# EasyEDA Pro project OpenIPC-Optical(工程文件)2025-11-24.epro, schematic OpenIPC_Opticalboard

## Sheets
1 P1: Board Name: OpenIPC_Opticalboard; Create Date: 2025-08-15; Page Name: P1; Project Name: OpenIPC-Optical; Schematic Name: OpenIPC_Opticalboard; Update Date: 2025-08-15; Company: CDUT; Drawed: urmouky; Page Size: A3; Version: V0.1
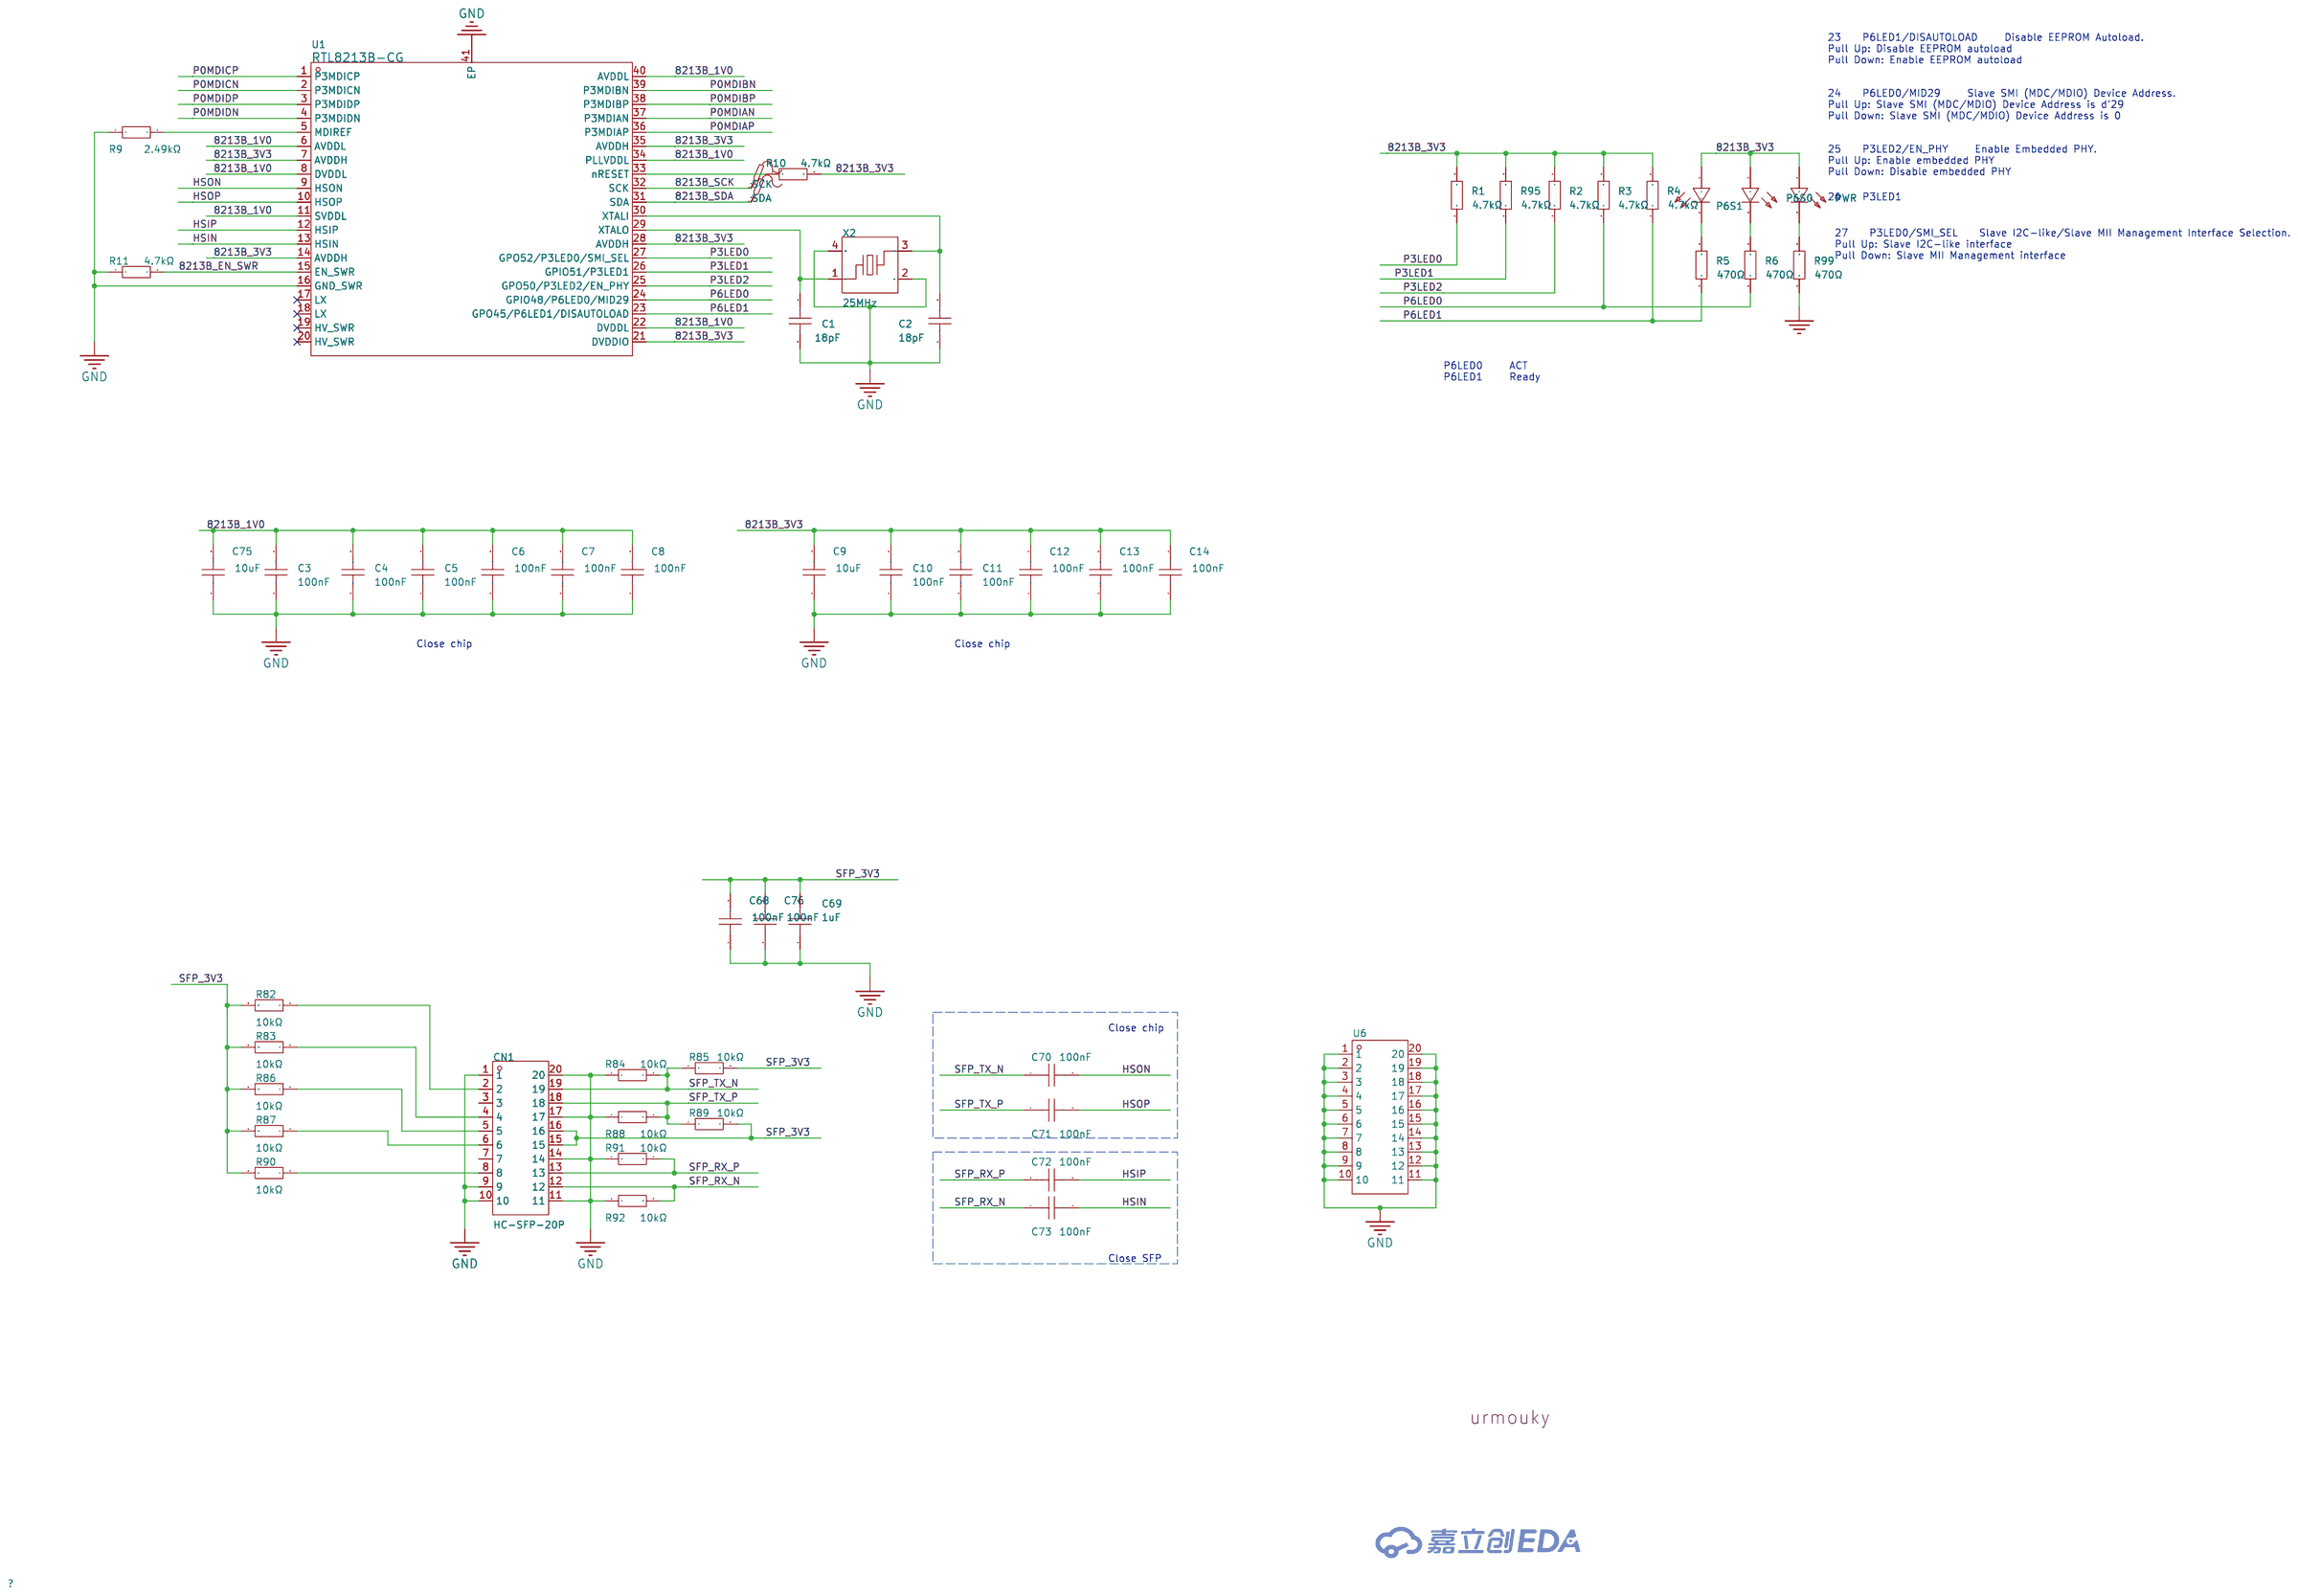
[diagram p0: P1]
2 P2: Page Name: P2
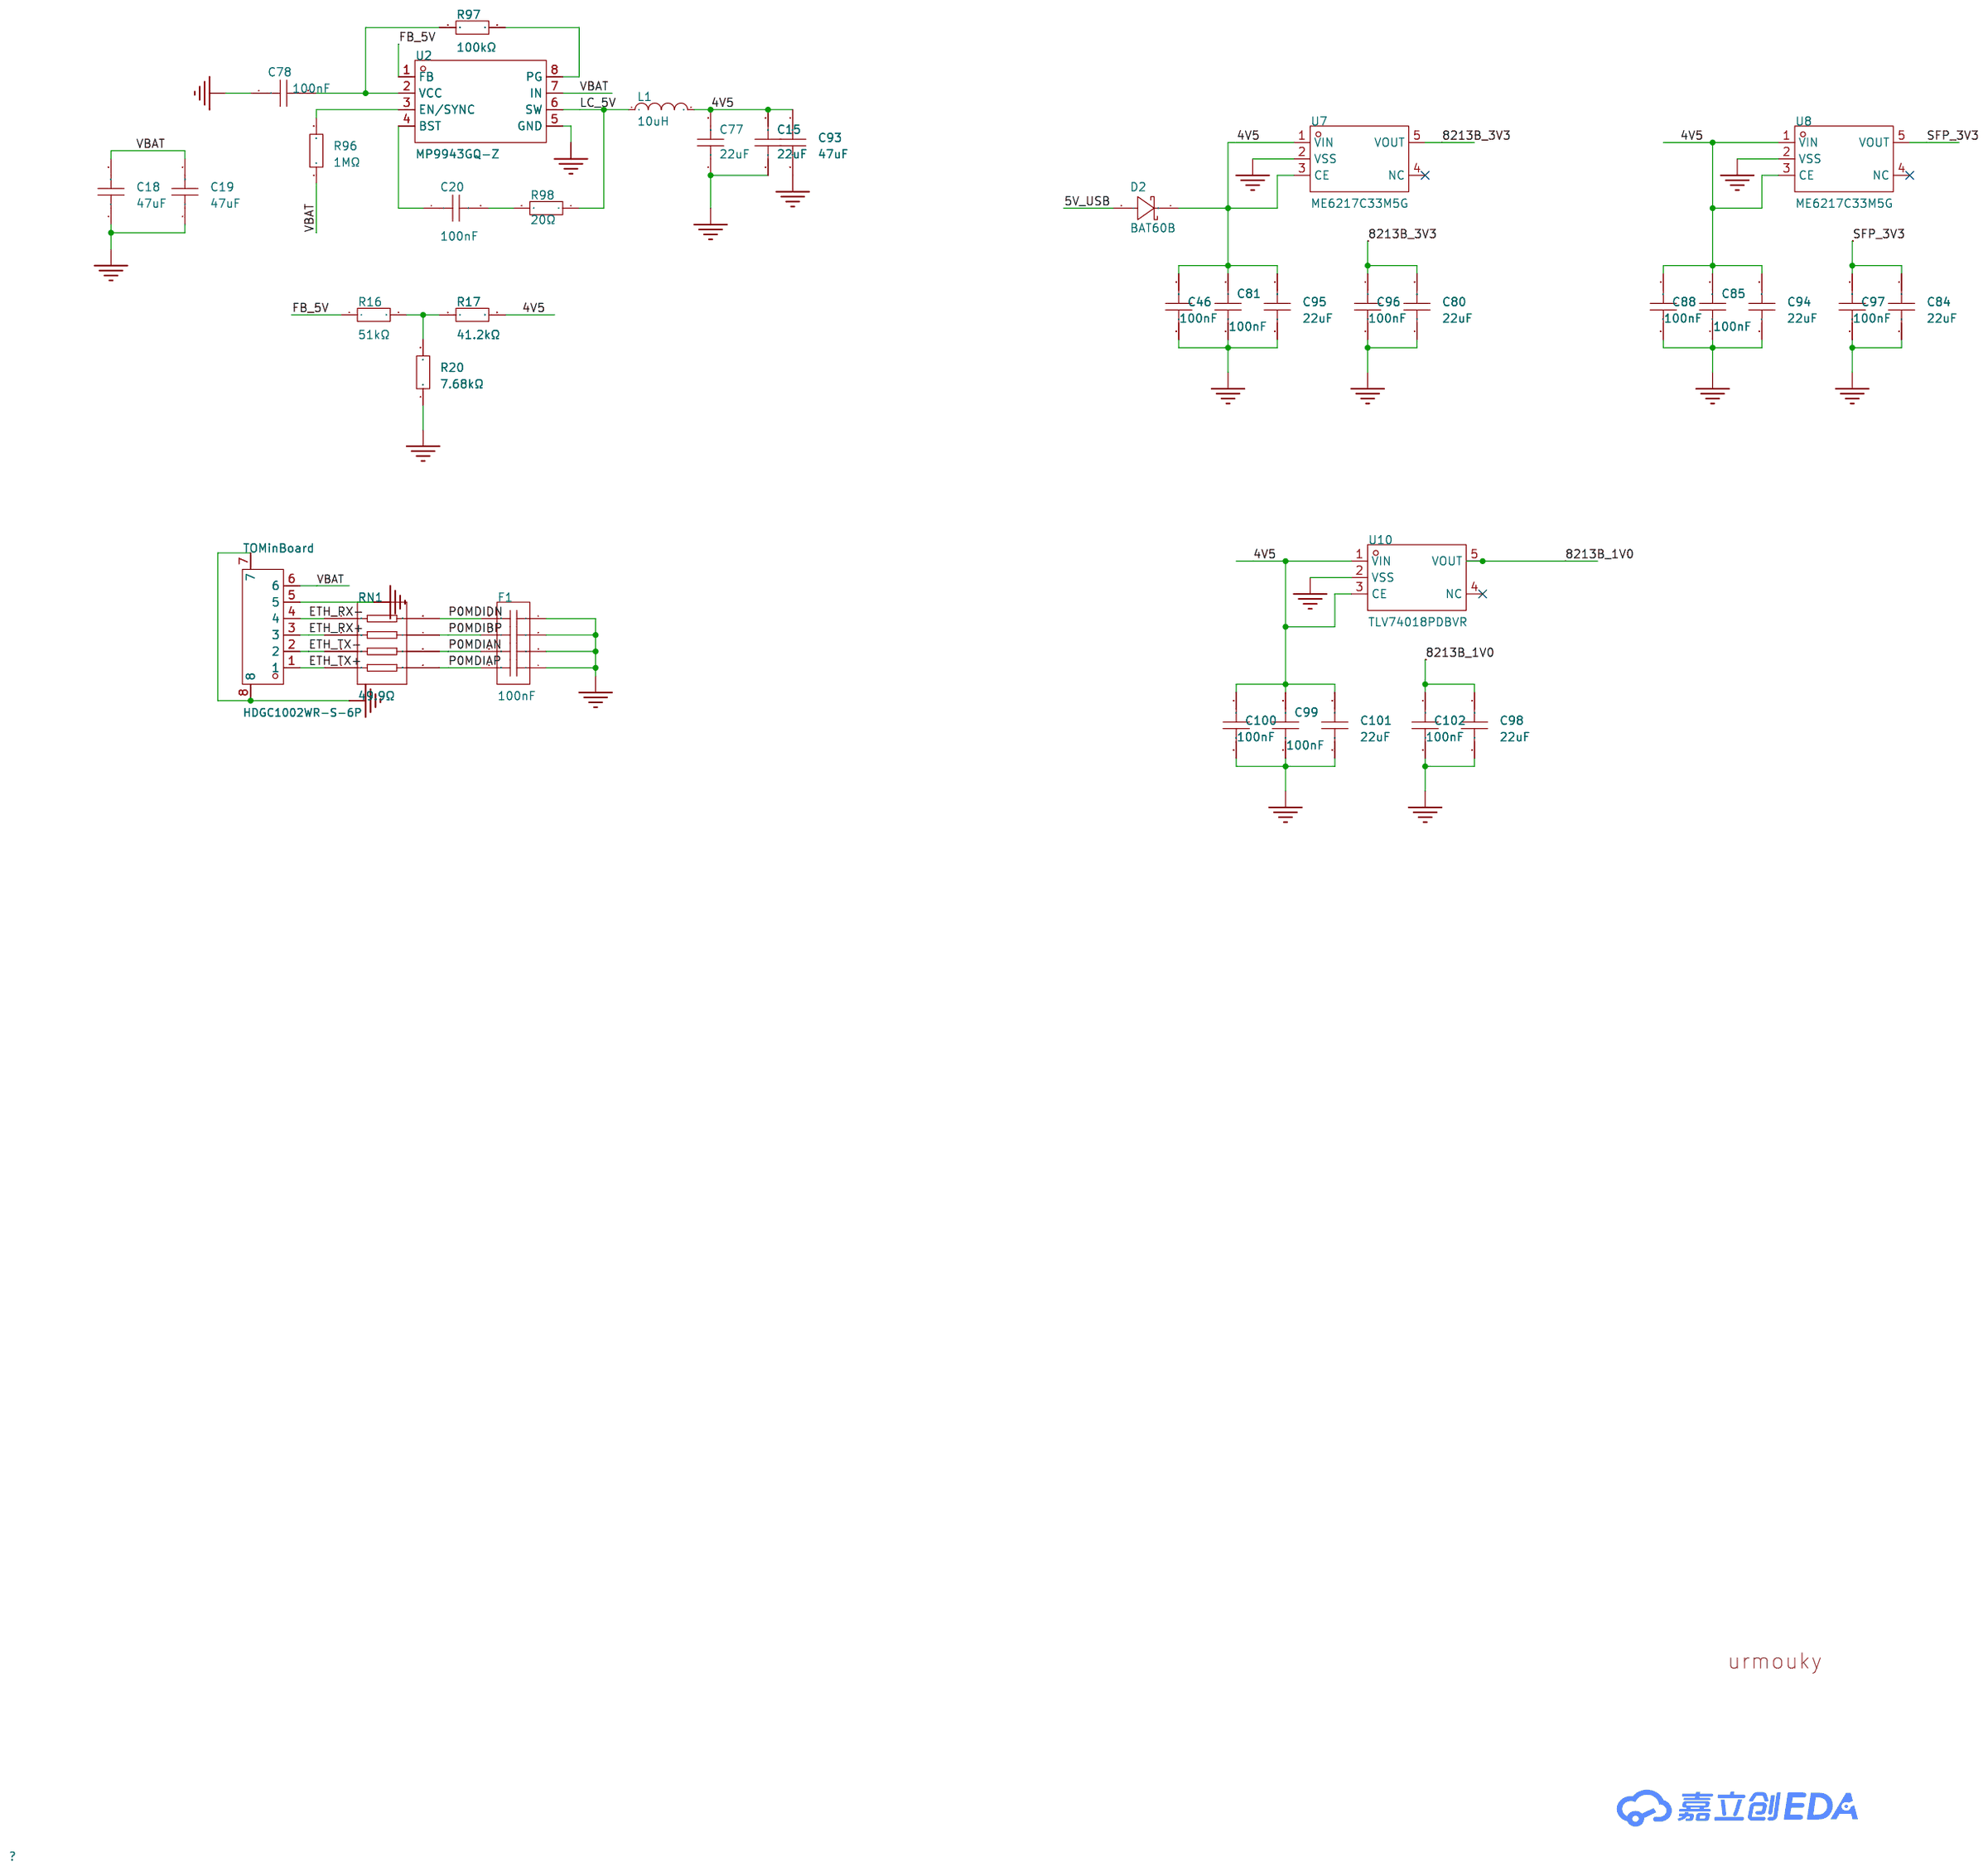
[diagram p1: P2]

## Parts
sheet P1
C1  18pF  [R0402]
C2  18pF  [R0402]
C3  100nF  [R0402]
C4  100nF  [R0402]
C5  100nF  [R0402]
C6  100nF  [R0402]
C7  100nF  [R0402]
C8  100nF  [R0402]
C9  10uF  [R0603]
C10  100nF  [R0402]
C11  100nF  [R0402]
C12  100nF  [R0402]
C13  100nF  [R0402]
C14  100nF  [R0402]
C68  100nF  [R0402]
C69  1uF  [R0603]
C70  100nF  [R0402]
C71  100nF  [R0402]
C72  100nF  [R0402]
C73  100nF  [R0402]
C75  10uF  [R0603]
C76  100nF  [R0402]
CN1  HC-SFP-20P  [CONN-SMD_20P-P0.80_HCTL_HC-SFP-20P]
P6S0  NCD0402G1  [LED0402-RD]
P6S1  NCD0402G1  [LED0402-RD]
PWR  NCD0402G1  [LED0402-RD]
R1  4.7kΩ  [R0402]
R2  4.7kΩ  [R0402]
R3  4.7kΩ  [R0402]
R4  4.7kΩ  [R0402]
R5  470Ω  [R0402]
R6  470Ω  [R0402]
R9  2.49kΩ  [R0402]
R10  4.7kΩ  [R0402]
R11  4.7kΩ  [R0402]
R82  10kΩ  [R0402]
R83  10kΩ  [R0402]
R84  10kΩ  [R0402]  (no BOM)
R85  10kΩ  [R0402]  (no BOM)
R86  10kΩ  [R0402]
R87  10kΩ  [R0402]
R88  10kΩ  [R0402]  (no BOM)
R89  10kΩ  [R0402]  (no BOM)
R90  10kΩ  [R0402]
R91  10kΩ  [R0402]  (no BOM)
R92  10kΩ  [R0402]  (no BOM)
R95  4.7kΩ  [R0402]
R99  470Ω  [R0402]
SCK  -  [Test-Point-0.5mm]
SDA  -  [Test-Point-0.5mm]
U1  RTL8213B-CG  [QFN-40_L5.0-W5.0-P0.40-BL-EP3.7]
U6  HC-SFP-01L  [TH_HC-SFP-01L]  (no BOM)
X2  25MHz  [CRYSTAL-SMD_4P-L2.0-W1.6-BL]
sheet P2
C15  22uF  [C0603]
C18  47uF  [C1206]
C19  47uF  [C1206]
C20  100nF  [C0402]
C46  100nF  [R0402]
C77  22uF  [C0603]
C78  100nF  [C0402]
C80  22uF  [C0603]
C81  100nF  [R0402]
C84  22uF  [C0603]
C85  100nF  [R0402]
C88  100nF  [R0402]
C93  47uF  [C1206]
C94  22uF  [C0603]
C95  22uF  [C0603]
C96  100nF  [R0402]
C97  100nF  [R0402]
C98  22uF  [C0603]
C99  100nF  [R0402]
C100  100nF  [R0402]
C101  22uF  [C0603]
C102  100nF  [R0402]
D2  BAT60B  [SOD-323_L1.7-W1.3-LS2.6-RD-1]
F1  100nF  [CAP-ARRAY-SMD_0508-8P-L2.0-W1.3-BL]  (no BOM)
L1  10uH  [IND-SMD_L4.4-W4.2]
R16  51kΩ  [R0402]
R17  41.2kΩ  [R0402]
R20  7.68kΩ  [R0402]
R96  1MΩ  [R0402]
R97  100kΩ  [R0402]
R98  20Ω  [R0402]
RN1  49.9Ω  [RES-ARRAY-SMD_0402-8P-L2.0-W1.0-BL]
TOMinBoard  HDGC1002WR-S-6P  [CONN-SMD_6P-P1.00_HDGC1002WR-S-6P]
U2  MP9943GQ-Z  [QFN-8_L3.0-W3.0-P0.65-BL]
U7  ME6217C33M5G  [SOT-23-5_L3.0-W1.7-P0.95-LS2.8-BR]
U8  ME6217C33M5G  [SOT-23-5_L3.0-W1.7-P0.95-LS2.8-BR]
U10  TLV74018PDBVR  [SOT-23-5_L2.9-W1.6-P0.95-LS2.8-BL]

## Library data of the parts
C1 C2 = 0402CG180J500NT: 容值:18pF;精度:±5%;额定电压:50V;材质(温度系数):C0G;; LCSC Part Name: 18pF ±5% 50V; Supplier Part: C1549; Manufacturer: FH(风华); Supplier Footprint: 0402; JLCPCB Part Class: Basic Part; Datasheet: https://atta.szlcsc.com/upload/public/pdf/source/20170923/C1549_1506149266585988356.pdf; Supplier: LCSC; Tolerance: ±5%; Voltage Rated: 50V; Temperature Coefficient: C0G
C3-C8 C10-C14 C68 C70-C73 C76 = CL05B104KO5NNNC: 容值:100nF;精度:±10%;额定电压:16V;材质(温度系数):X7R;; LCSC Part Name: 100nF ±10% 16V; Supplier Part: C1525; Manufacturer: SAMSUNG(三星); Supplier Footprint: 0402; JLCPCB Part Class: Basic Part; Datasheet: https://atta.szlcsc.com/upload/public/pdf/source/20160103/1457707674891.pdf; Supplier: LCSC; Tolerance: ±10%; Voltage Rated: 16V; Temperature Coefficient: X7R
C9 C75 = CL10A106MA8NRNC: 容值:10uF;精度:±20%;额定电压:25V;材质(温度系数):X5R;; LCSC Part Name: 10uF ±20% 25V; Supplier Part: C96446; Manufacturer: SAMSUNG(三星); Supplier Footprint: 0603; JLCPCB Part Class: Basic Part; Datasheet: https://atta.szlcsc.com/upload/public/pdf/source/20170325/1490427913016.pdf; Supplier: LCSC; Tolerance: ±20%; Voltage Rated: 25V; Temperature Coefficient: X5R
C69 = CL10A105KB8NNNC: 容值:1uF;精度:±10%;额定电压:50V;材质(温度系数):X5R;; LCSC Part Name: 1uF ±10% 50V; Supplier Part: C15849; Manufacturer: SAMSUNG(三星); Supplier Footprint: 0603; JLCPCB Part Class: Basic Part; Datasheet: https://atta.szlcsc.com/upload/public/pdf/source/20160103/1457707679084.pdf; Supplier: LCSC; Tolerance: ±10%; Voltage Rated: 50V; Temperature Coefficient: X5R
CN1 = HC-SFP-20P: Supplier Part: C2897291; Manufacturer: HCTL(华灿天禄); Supplier Footprint: SMD,P=0.8mm,卧贴; JLCPCB Part Class: Extended Part; Datasheet: https://atta.szlcsc.com/upload/public/pdf/source/20210914/BA7BB8E5B2F161D6EB896D34EBE70234.pdf; Supplier: LCSC
P6S0 P6S1 PWR = NCD0402G1: 发光颜色:翠绿色;正向电压(VF):2.6V~3.6V;功率:72mW;正向电流:5mA;主波长:515nm~530nm;透镜颜色:无色透明透镜;发光强度:100mcd~270mcd;发光角度:130°;工作温度:-30℃~+85℃;; Supplier Part: C130723; Manufacturer: 国星光电; Supplier Footprint: 0402; JLCPCB Part Class: Extended Part; Datasheet: https://atta.szlcsc.com/upload/public/pdf/source/20200820/C130723_D39B4171A1B8D8D2F39C1DC521C0922A.pdf; Supplier: LCSC; Emitted Color: 翠绿色; Forward Voltage (VF): 2.6V~3.6V; Power Dissipation: 72mW; Forward Current: 5mA; Dominant Wavelength: 515nm~530nm; Lens Color: 无色透明透镜; Luminous Intensity: 100mcd~270mcd; Viewing Angle: 130°; Operating Temperature: -30℃~+85℃
R1-R4 R10 R11 R95 = 0402WGF4701TCE: 电阻类型:厚膜电阻;阻值:4.7kΩ;精度:±1%;功率:1/16W;温度系数:±100ppm/℃;最大工作电压:50V;工作温度范围:-55℃~+155℃;; LCSC Part Name: 4.7kΩ ±1% 1/16W; Supplier Part: C25900; Manufacturer: UNI-ROYAL(厚声); Supplier Footprint: 0402; JLCPCB Part Class: Basic Part; Datasheet: https://atta.szlcsc.com/upload/public/pdf/source/20200306/C422600_1E6D84923E4A46A82E41ADD87F860B5C.pdf; Supplier: LCSC; Type: 厚膜电阻; Tolerance: ±1%; Power(Watts): 1/16W; Temperature Coefficient: ±100ppm/℃; Overload Voltage (Max): 50V; Operating Temperature Range: -55℃~+155℃
R5 R6 R99 = 0402WGF4700TCE: 电阻类型:厚膜电阻;阻值:470Ω;精度:±1%;功率:62.5mW;温度系数:±100ppm/℃;最大工作电压:50V;工作温度范围:-55℃~+155℃;; LCSC Part Name: 470Ω ±1% 62.5mW; Supplier Part: C25117; Manufacturer: UNI-ROYAL(厚声); Supplier Footprint: 0402; JLCPCB Part Class: Basic Part; Datasheet: https://atta.szlcsc.com/upload/public/pdf/source/20200306/C422600_1E6D84923E4A46A82E41ADD87F860B5C.pdf; Supplier: LCSC; Type: 厚膜电阻; Tolerance: ±1%; Power(Watts): 62.5mW; Temperature Coefficient: ±100ppm/℃; Overload Voltage (Max): 50V; Operating Temperature Range: -55℃~+155℃
R9 = RC0402FR-072K49L: 功率:1/16W;阻值:2.49kΩ;精度:±1%;温度系数:±100ppm/℃;最大工作电压:50V;工作温度范围:-55℃~+155℃;; LCSC Part Name: 2.49kΩ ±1%; Supplier Part: C145071; Manufacturer: YAGEO(国巨); Supplier Footprint: 0402; JLCPCB Part Class: Extended Part; Datasheet: https://atta.szlcsc.com/upload/public/pdf/source/20171221/C145071_15138311814201195405.pdf; Supplier: LCSC; Power(Watts): 1/16W; Tolerance: ±1%; Temperature Coefficient: ±100ppm/℃; Overload Voltage (Max): 50V; Operating Temperature Range: -55℃~+155℃
R82 R83 R86 R87 R90 = 0402WGF1002TCE: 电阻类型:厚膜电阻;阻值:10kΩ;精度:±1%;功率:62.5mW;温度系数:±100ppm/℃;最大工作电压:50V;工作温度范围:-55℃~+155℃;; LCSC Part Name: 10kΩ ±1% 62.5mW; Supplier Part: C25744; Manufacturer: UNI-ROYAL(厚声); Supplier Footprint: 0402; JLCPCB Part Class: Basic Part; Datasheet: https://atta.szlcsc.com/upload/public/pdf/source/20200306/C422600_1E6D84923E4A46A82E41ADD87F860B5C.pdf; Supplier: LCSC; Type: 厚膜电阻; Tolerance: ±1%; Power(Watts): 62.5mW; Temperature Coefficient: ±100ppm/℃; Overload Voltage (Max): 50V; Operating Temperature Range: -55℃~+155℃
R84 R85 R88 R89 R91 R92 = 0402WGF1002TCE: 电阻类型:厚膜电阻;阻值:10kΩ;精度:±1%;功率:62.5mW;工作电压:50V;温度系数:±100ppm/℃;; LCSC Part Name: 10kΩ ±1% 62.5mW; Supplier Part: C25744; Manufacturer: UNI-ROYAL(厚声); Supplier Footprint: 0402; JLCPCB Part Class: Basic Part; Datasheet: https://atta.szlcsc.com/upload/public/pdf/source/20200306/C422600_1E6D84923E4A46A82E41ADD87F860B5C.pdf; Supplier: LCSC; Type: 厚膜电阻; Tolerance: ±1%; Power(Watts): 62.5mW; Temperature Coefficient: ±100ppm/℃; Overload Voltage (Max): 50V; Operating Temperature Range: -55℃~+155℃; Voltage-Supply(Max): 50V; Operating Temperature: -55℃~+155℃
SCK SDA = Test-Point: Test Point 测试点
U1 = RTL8213B-CG: 应用功能:-;通道数:1;接口类型:SGMII;; Supplier Part: C2766076; Manufacturer: REALTEK(瑞昱); Supplier Footprint: QFN-40-EP(5x5); JLCPCB Part Class: 扩展库; Datasheet: https://atta.szlcsc.com/upload/public/pdf/source/20240125/4FAE948FC8054805EFA4DC6DA88B16DA.pdf; Supplier: LCSC; Number of Channels: 1; Interface: SGMII; Voltage - Supply: 3.3V；1.1V; Current - Supply: 70mA；218mA; Operating Temperature: 0℃~+70℃
U6 = HC-SFP-01L: LCSC Part Name: SFP外壳; Supplier Part: C2897292; Manufacturer: HCTL(华灿天禄); JLCPCB Part Class: 扩展库; Datasheet: https://atta.szlcsc.com/upload/public/pdf/source/20210914/D263BD6202628DAF148611CD07FFF2AC.pdf; Supplier: LCSC
X2 = SX1B25.000F1210F30: 晶振类型:贴片晶振;频率:25MHz;常温频差:±10ppm;负载电容:12pF;频率稳定度:±30ppm;; LCSC Part Name: 25MHz ±10ppm 12pF; Supplier Part: C7301945; Manufacturer: SCTF(星通时频); Supplier Footprint: SMD2016-4P; JLCPCB Part Class: 扩展库; Datasheet: https://item.szlcsc.com/datasheet/SX1B25.000F1210F30/8272198.html; Supplier: LCSC; Type: 贴片晶振; Normal temperature Frequency Tolerance: ±10ppm; Load Capacitance: 12pF; Frequency Stability: ±30ppm; Equivalent Series Resistance(ESR): 80Ω; Operating Temperature: -40℃~+85℃
C15 C77 C80 C84 C94 C95 C98 C101 = CL10A226MQ8NRNC: 容值:22uF;精度:±20%;额定电压:6.3V;材质(温度系数):X5R;; LCSC Part Name: 22uF ±20% 6.3V; Supplier Part: C59461; Manufacturer: SAMSUNG(三星); Supplier Footprint: 0603; JLCPCB Part Class: Basic Part; Datasheet: https://atta.szlcsc.com/upload/public/pdf/source/20160218/1457707763339.pdf; Supplier: LCSC; Tolerance: ±20%; Voltage Rated: 6.3V; Temperature Coefficient: X5R
C18 C19 C93 = CL31A476MPHNNNE: 容值:47uF;精度:±20%;额定电压:10V;材质(温度系数):X5R;; LCSC Part Name: 47uF ±20% 10V; Supplier Part: C96123; Manufacturer: SAMSUNG(三星); Supplier Footprint: 1206; JLCPCB Part Class: Basic Part; Datasheet: https://atta.szlcsc.com/upload/public/pdf/source/20170228/1488267692219.pdf; Supplier: LCSC; Tolerance: ±20%; Voltage Rated: 10V; Temperature Coefficient: X5R
C20 C78 C81 C85 C99 = GRM155R71H104KE14D: 容值:100nF;精度:±10%;额定电压:50V;材质(温度系数):X7R;; LCSC Part Name: 100nF ±10% 50V; Supplier Part: C77020; Manufacturer: muRata(村田); Supplier Footprint: 0402; JLCPCB Part Class: Extended Part; Datasheet: https://atta.szlcsc.com/upload/public/pdf/source/20180326/C77020_39BD49C951FF1AF0DB1F1FAC5AC1E401.pdf; Supplier: LCSC; Tolerance: ±10%; Voltage Rated: 50V; Temperature Coefficient: X7R
C46 C88 C96 C97 C100 C102 = GRM155R71H104KE14D: 容值:100nF;精度:±10%;额定电压:50V;材质(温度系数):X7R;; LCSC Part Name: 100nF ±10% 50V; Supplier Part: C77020; Manufacturer: muRata(村田); Supplier Footprint: 0402; JLCPCB Part Class: Extended Part; Datasheet: https://atta.szlcsc.com/upload/public/pdf/source/20180326/C77020_39BD49C951FF1AF0DB1F1FAC5AC1E401.pdf; Supplier: LCSC; Tolerance: ±10%; Voltage Rated: 50V; Temperature Coefficient: X7R; 3DModel: C0402_L1.0-W0.5-H0.5
D2 = BAT60B_C7502695: 二极管配置:独立式;正向压降(Vf):600mV@1A;直流反向耐压(Vr):10V;整流电流:3A;; LCSC Part Name: 电压:10V 电流:3A; Supplier Part: C7502695; Manufacturer: 宏迦橙; Supplier Footprint: SOD-323; JLCPCB Part Class: Extended Part; Datasheet: https://atta.szlcsc.com/upload/public/pdf/source/20230828/25AE167151E881636AF68D9C9ECB5F9C.pdf; Supplier: LCSC; Diode Configuration: 独立式; Forward Voltage (Vf@If): 600mV@1A; Reverse Voltage (Vr): 10V; Rectified Current: 3A; Reverse Leakage Current (Ir): 25uA; Average Rectified Current (Io): 3A
F1 = CA0508KRX7R7BB104: 容值:100nF;精度:±10%;额定电压:16V;温度系数:X7R;电路形式:隔离;; Supplier Part: C1870407; Manufacturer: YAGEO(国巨); Supplier Footprint: 0508; JLCPCB Part Class: 扩展库; Datasheet: https://atta.szlcsc.com/upload/public/pdf/source/20220525/176E31E9D3C0708DD2DF020B4CF8BD4B.pdf; Supplier: LCSC; Tolerance: ±10%; Rated Voltage: 16V; Temperature Coefficient: X7R; Number of Capacitors: 4; Circuit Type: 隔离
L1 = FXL0420-100-M: 电感值:10uH;精度:±20%;额定电流:1.6A;饱和电流(Isat):2.2A;类型:一体成型电感;; LCSC Part Name: 10uH ±20% 2.2A; Supplier Part: C177242; Manufacturer: cjiang(长江微电); Supplier Footprint: SMD,4.2x4.4mm; JLCPCB Part Class: Extended Part; Datasheet: https://atta.szlcsc.com/upload/public/pdf/source/20200117/C485363_A2440626DC7482D75DD0DD56D1883FBF.pdf; Supplier: LCSC; Tolerance: ±20%; Rated Current: 1.6A; Saturation Current (Isat): 2.2A; DC Resistance (DCR): 282mΩ; Type: 一体成型电感
R16 = 0402WGF5102TCE: 电阻类型:厚膜电阻;阻值:51kΩ;精度:±1%;功率:62.5mW;最大工作电压:50V;温度系数:±100ppm/℃;; LCSC Part Name: 51kΩ ±1% 62.5mW 厚膜电阻; Supplier Part: C25794; Manufacturer: UNI-ROYAL(厚声); Supplier Footprint: 0402; JLCPCB Part Class: Basic Part; Datasheet: https://atta.szlcsc.com/upload/public/pdf/source/20200306/C422600_1E6D84923E4A46A82E41ADD87F860B5C.pdf; Supplier: LCSC; Type: 厚膜电阻; Tolerance: ±1%; Power(Watts): 62.5mW; Overload Voltage (Max): 50V; Temperature Coefficient: ±100ppm/℃; Operating Temperature Range: -55℃~+155℃
R17 = 0402WGF4122TCE: 电阻类型:厚膜电阻;阻值:41.2kΩ;精度:±1%;功率:62.5mW;最大工作电压:50V;温度系数:±100ppm/℃;; LCSC Part Name: 41.2kΩ ±1% 62.5mW 厚膜电阻; Supplier Part: C26978; Manufacturer: UNI-ROYAL(厚声); Supplier Footprint: 0402; JLCPCB Part Class: Extended Part; Datasheet: https://atta.szlcsc.com/upload/public/pdf/source/20200306/C422600_1E6D84923E4A46A82E41ADD87F860B5C.pdf; Supplier: LCSC; Type: 厚膜电阻; Tolerance: ±1%; Power(Watts): 62.5mW; Overload Voltage (Max): 50V; Temperature Coefficient: ±100ppm/℃; Operating Temperature Range: -55℃~+155℃
R20 = 0402WGF7681TCE: 电阻类型:厚膜电阻;阻值:7.68kΩ;精度:±1%;功率:62.5mW;最大工作电压:50V;温度系数:±100ppm/℃;; LCSC Part Name: 7.68kΩ ±1% 62.5mW 厚膜电阻; Supplier Part: C25919; Manufacturer: UNI-ROYAL(厚声); Supplier Footprint: 0402; JLCPCB Part Class: Extended Part; Datasheet: https://atta.szlcsc.com/upload/public/pdf/source/20200306/C422600_1E6D84923E4A46A82E41ADD87F860B5C.pdf; Supplier: LCSC; Type: 厚膜电阻; Tolerance: ±1%; Power(Watts): 62.5mW; Overload Voltage (Max): 50V; Temperature Coefficient: ±100ppm/℃; Operating Temperature Range: -55℃~+155℃
R96 = 0402WGF1004TCE: 电阻类型:厚膜电阻;阻值:1MΩ;精度:±1%;功率:62.5mW;最大工作电压:50V;温度系数:±100ppm/℃;; LCSC Part Name: 1MΩ ±1% 62.5mW 厚膜电阻; Supplier Part: C26083; Manufacturer: UNI-ROYAL(厚声); Supplier Footprint: 0402; JLCPCB Part Class: Basic Part; Datasheet: https://atta.szlcsc.com/upload/public/pdf/source/20200306/C422600_1E6D84923E4A46A82E41ADD87F860B5C.pdf; Supplier: LCSC; Type: 厚膜电阻; Tolerance: ±1%; Power(Watts): 62.5mW; Overload Voltage (Max): 50V; Temperature Coefficient: ±100ppm/℃; Operating Temperature Range: -55℃~+155℃
R97 = RC0402FR-07100KL: 电阻类型:厚膜电阻;阻值:100kΩ;精度:±1%;功率:62.5mW;最大工作电压:50V;温度系数:±100ppm/℃;; LCSC Part Name: 厚膜电阻 100kΩ ±1% 62.5mW; Supplier Part: C60491; Manufacturer: YAGEO(国巨); Supplier Footprint: 0402; JLCPCB Part Class: Extended Part; Datasheet: https://atta.szlcsc.com/upload/public/pdf/source/20180927/C295883_E8D83085EA81BD7DE0B2B681138C15EE.pdf; Supplier: LCSC; Type: 厚膜电阻; Tolerance: ±1%; Power(Watts): 62.5mW; Overload Voltage (Max): 50V; Temperature Coefficient: ±100ppm/℃; Operating Temperature Range: -55℃~+155℃
R98 = 0402WGF200JTCE: 电阻类型:厚膜电阻;阻值:20Ω;精度:±1%;功率:62.5mW;最大工作电压:50V;温度系数:±200ppm/℃;; LCSC Part Name: 20Ω ±1% 62.5mW 厚膜电阻; Supplier Part: C25089; Manufacturer: UNI-ROYAL(厚声); Supplier Footprint: 0402; JLCPCB Part Class: Extended Part; Datasheet: https://atta.szlcsc.com/upload/public/pdf/source/20200306/C422600_1E6D84923E4A46A82E41ADD87F860B5C.pdf; Supplier: LCSC; Type: 厚膜电阻; Tolerance: ±1%; Power(Watts): 62.5mW; Overload Voltage (Max): 50V; Temperature Coefficient: ±200ppm/℃; Operating Temperature Range: -55℃~+155℃
RN1 = 4D02WGJ0220TCE: 电阻器数:4;阻值:22Ω;精度:±5%;单个元件功率:62.5mW;温度系数:±200ppm/℃;; LCSC Part Name: 22Ω ±5%; Supplier Part: C25499; Manufacturer: UNI-ROYAL(厚声); Supplier Footprint: 0402x4; JLCPCB Part Class: Extended Part; Datasheet: https://atta.szlcsc.com/upload/public/pdf/source/20191224/C474318_2527498AE30E813171187CCD28401A71.pdf; Supplier: LCSC; Number of Resistors: 4; Tolerance: ±5%; Power(Watts): 62.5mW; Temperature Coefficient: ±200ppm/℃; Number of Pins: 8
TOMinBoard = HDGC1002WR-S-6P: 参考系列:SH;间距:1mm;排数:1;每排PIN数:6;公母:公型插针;安装方式:卧贴;额定电流:1A;工作温度范围:-40℃~+85℃;; LCSC Part Name: SH 1mm 卧贴; Supplier Part: C3041141; Manufacturer: HDGC(华德共创); Supplier Footprint: SMD,P=1mm; JLCPCB Part Class: 扩展库; Datasheet: https://atta.szlcsc.com/upload/public/pdf/source/20220621/C2AA6A1A2A279F73FC0521BA202CB6E2.pdf; Supplier: LCSC; Reference Series: SH; Pitch: 1mm; Number of Rows: 1; Number of PINs Per Row: 6; Gender: 公型插针; Mounting Style: 卧贴; Current Rating (Max): 1A; Operating Temperature Range: -40℃~+85℃
U2 = MP9943GQ-Z: Supplier Part: C477821; Supplier Footprint: QFN-8_3x3mm; JLCPCB Part Class: 扩展库; Datasheet: 2021-05-22/374398S/94eb60b6438e46f987ac1f72df989e4b/MP9943.pdf; Supplier: LCSC; Standardization Check: true
U7 U8 = ME6217C33M5G: 输出类型:固定;输出极性:正;最大输入电压:7V;输出电压:3.3V;输出电流:800mA;电源纹波抑制比(PSRR):65dB@(1kHz);; Supplier Part: C427602; Manufacturer: MICRONE(南京微盟); Supplier Footprint: SOT-23-5; JLCPCB Part Class: 扩展库; Datasheet: https://atta.szlcsc.com/upload/public/pdf/source/20190910/C427602_D4B9162A2E9D9EF57C60010DFDECEF37.pdf; Supplier: LCSC; Output Type: 固定; Output Polarity: 正; Number of Outputs: 1; Maximum Input Voltage: 7V; Output Voltage: 3.3V; Dropout Voltage: 180mV@(300mA); Output Current: 800mA; Power Supply Rejection Ratio (PSRR): 65dB@(1kHz)
U10 = TLV74018PDBVR: 输出类型:固定;最大输入电压:5.5V;输出电压:1.8V;输出电流:300mA;电源纹波抑制比(PSRR):-;输出极性:正极;; LCSC Part Name: 具有折返电流限制的 300mA 低压降 (LDO) 稳压器; Supplier Part: C3746861; Manufacturer: TI(德州仪器); Supplier Footprint: SOT-23-5; JLCPCB Part Class: Extended Part; Datasheet: https://www.ti.com/cn/lit/gpn/tlv740p; Supplier: LCSC; Output Type: 固定; Maximum Input Voltage: 5.5V; Output Voltage: 1.8V; Output Current: 300mA; Dropout Voltage: 800mV@(300mA); standby current: 80uA; Feature: 低ESR；过流保护(OCP)；防静电保护；浪涌保护；自动放电功能；热保护(TSD)；欠压闭锁；带使能；防倒灌; Operating Temperature: -40℃~+125℃@(Tj); Output Polarity: 正极; Number of Outputs: 1

## Nets
4V5: C15.2 C46.1 C77.2 C81.2 C85.2 C88.1 C93.1 C94.2 C95.2 C99.2 C100.1 C101.2 D2.1(C) L1.2 R17.2 U7.1(VIN) U7.3(CE) U8.1(VIN) U8.3(CE) U10.1(VIN) U10.3(CE)
5V_USB: D2.2(A)
GND: C1.2 C2.1 C3.1 C4.1 C5.1 C6.1 C7.1 C8.1 C9.1 C10.1 C11.1 C12.1 C13.1 C14.1 C15.1 C18.1 C19.1 C46.2 C68.1 C69.1 C75.1 C76.1 C77.1 C78.1 C80.1 C81.1 C84.1 C85.1 C88.2 C93.2 C94.1 C95.1 C96.2 C97.2 C98.1 C99.1 C100.2 C101.1 C102.2 CN1.1 CN1.9 CN1.10 CN1.11 CN1.14 CN1.17 CN1.20 F1.1 F1.2 F1.3 F1.4 R9.1 R11.1 R20.1 R84.1 R88.1 R91.1 R92.1 R99.1 TOMinBoard.5 TOMinBoard.7 TOMinBoard.8 U1.16(GND_SWR) U1.41(EP) U2.5(GND) U6.1 U6.2 U6.3 U6.4 U6.5 U6.6 U6.7 U6.8 U6.9 U6.10 U6.11 U6.12 U6.13 U6.14 U6.15 U6.16 U6.17 U6.18 U6.19 U6.20 U7.2(VSS) U8.2(VSS) U10.2(VSS) X2.2(GND) X2.4(GND)
VBAT: C18.2 C19.2 R96.1 TOMinBoard.6 U2.7(IN)
8213B_1V0: C3.2 C4.2 C5.2 C6.2 C7.2 C8.2 C75.2 C98.2 C102.1 U1.6(AVDDL) U1.8(DVDDL) U1.11(SVDDL) U1.22(DVDDL) U1.34(PLLVDDL) U1.40(AVDDL) U10.5(VOUT)
8213B_3V3: C9.2 C10.2 C11.2 C12.2 C13.2 C14.2 C80.2 C96.1 P6S0.1(A) P6S1.1(A) PWR.1(A) R1.2 R2.1 R3.2 R4.2 R10.2 R95.2 U1.7(AVDDH) U1.14(AVDDH) U1.21(DVDDIO) U1.28(AVDDH) U1.35(AVDDH) U7.5(VOUT)
8213B_EN_SWR: R11.2 U1.15(EN_SWR)
8213B_SCK: SCK.1 U1.32(SCK)
8213B_SDA: SDA.1 U1.31(SDA)
ETH_RX+: RN1.2 TOMinBoard.3
ETH_RX-: RN1.1 TOMinBoard.4
ETH_TX+: RN1.4 TOMinBoard.1
ETH_TX-: RN1.3 TOMinBoard.2
FB_5V: R16.1 U2.1(FB)
HSIN: C73.2 U1.13(HSIN)
HSIP: C72.2 U1.12(HSIP)
HSON: C70.2 U1.9(HSON)
HSOP: C71.2 U1.10(HSOP)
LC_5V: L1.1 R98.1 U2.6(SW)
P0MDIAN: F1.6 RN1.6 U1.37(P3MDIAN)
P0MDIAP: F1.5 RN1.5 U1.36(P3MDIAP)
P0MDIBN: U1.39(P3MDIBN)
P0MDIBP: F1.7 RN1.7 U1.38(P3MDIBP)
P0MDICN: U1.2(P3MDICN)
P0MDICP: U1.1(P3MDICP)
P0MDIDN: F1.8 RN1.8 U1.4(P3MDIDN)
P0MDIDP: U1.3(P3MDIDP)
P3LED0: R1.1 U1.27(GPO52/P3LED0/SMI_SEL)
P3LED1: R95.1 U1.26(GPIO51/P3LED1)
P3LED2: R2.2 U1.25(GPO50/P3LED2/EN_PHY)
P6LED0: R3.1 R6.1 U1.24(GPIO48/P6LED0/MID29)
P6LED1: R4.1 R5.1 U1.23(GPO45/P6LED1/DISAUTOLOAD)
SFP_3V3: C68.2 C69.2 C76.2 C84.2 C97.1 CN1.15 CN1.16 R82.2 R83.2 R85.2 R86.2 R87.2 R89.2 R90.2 U8.5(VOUT)
SFP_RX_N: C73.1 CN1.12 R92.2
SFP_RX_P: C72.1 CN1.13 R91.2
SFP_TX_N: C70.1 CN1.19 R84.2 R85.1
SFP_TX_P: C71.1 CN1.18 R88.2 R89.1
$1N1852: C1.1 U1.29(XTALO) X2.1
$1N1863: R10.1 U1.33(nRESET)
$1N1904: R9.2 U1.5(MDIREF)
$1N1912: C2.2 U1.30(XTALI) X2.3
$1N1945: P6S1.2(K) R5.2
$1N1946: P6S0.2(K) R6.2
$1N2817: CN1.5 R86.1
$1N2818: CN1.4 R83.1
$1N2820: CN1.6 R87.1
$1N2821: CN1.2 R82.1
$1N2827: CN1.8 R90.1
$1N6453: PWR.2(K) R99.2
$2N900: R97.2 U2.8(PG)
$2N902: C20.2 R98.2
$2N903: C78.2 R97.1 U2.2(VCC)
$2N910: R16.2 R17.1 R20.2
$2N915: C20.1 U2.4(BST)
$2N918: R96.2 U2.3(EN/SYNC)

Not connected (* = marked no-connect by the designer): CN1 3 7; U1 17(LX)* 18(LX)* 19(HV_SWR)* 20(HV_SWR)*; U7 4(NC)*; U8 4(NC)*; U10 4(NC)*

## Notes on the sheets
sheet 1
- 23    P6LED1/DISAUTOLOAD     Disable EEPROM Autoload.
  Pull Up: Disable EEPROM autoload
  Pull Down: Enable EEPROM autoload
- 24    P6LED0/MID29     Slave SMI (MDC/MDIO) Device Address.
  Pull Up: Slave SMI (MDC/MDIO) Device Address is d’29
  Pull Down: Slave SMI (MDC/MDIO) Device Address is 0
- 25    P3LED2/EN_PHY     Enable Embedded PHY.
  Pull Up: Enable embedded PHY
  Pull Down: Disable embedded PHY
- 26    P3LED1
- 27    P3LED0/SMI_SEL    Slave I2C-like/Slave MII Management Interface Selection.
  Pull Up: Slave I2C-like interface
  Pull Down: Slave MII Management interface
- P6LED0     ACT
  P6LED1     Ready
- Close chip
- Close chip
- Close chip
- Close SFP
